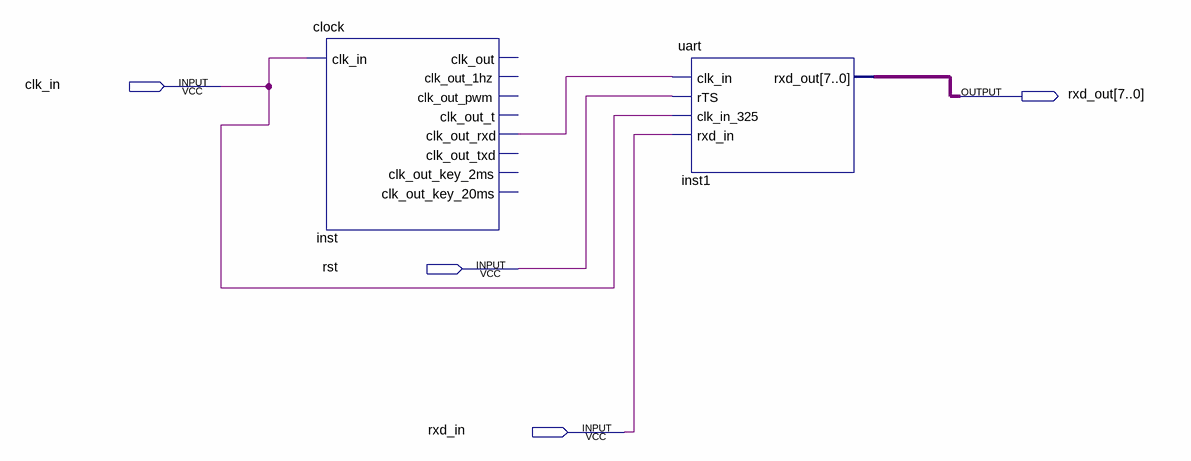
[diagram p0: schematic sheet]
// Quartus schematic uart_bdf.bdf as structural Verilog: 2 symbols, 4 pins
module uart_bdf (
  input  clk_in,
  input  rst,
  input  rxd_in,
  output [7:0] rxd_out
);

  wire inst_clk_out_rxd;

  clock inst (
    .clk_in(clk_in), .clk_out_rxd(inst_clk_out_rxd));  // open: clk_out, clk_out_1hz, clk_out_pwm, clk_out_t, clk_out_txd, clk_out_key_2ms, clk_out_key_20ms
  uart inst1 (.clk_in(inst_clk_out_rxd), .rTS(rst), .clk_in_325(clk_in), .rxd_in(rxd_in), .rxd_out(rxd_out));
endmodule
